# Altium project Debugger.PrjPcb
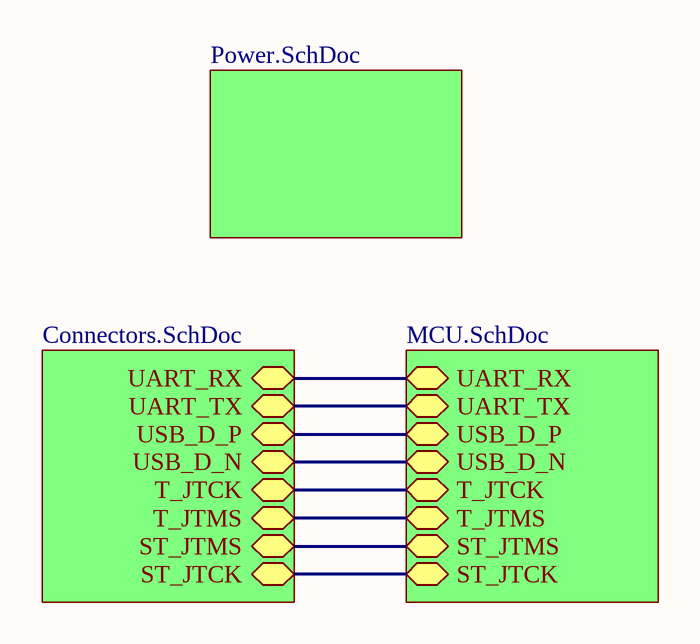
[diagram p0: TOP.SchDoc]
4 sheets, 39 parts. Net scope: hierarchical (ports join the sheet entries above them; power ports are global).
Board file: Debugger.PcbDoc
Sheets:
  TOP.SchDoc
    MCU = MCU.SchDoc
    POWER = Power.SchDoc
    CONNECTORS = Connectors.SchDoc

## Sheet TOP.SchDoc
size A4; Organization: Altium Limited; Address1: L3, 12a Rodborough Rd; Address2: Frenchs Forest; Address3: NSW; Address4: Australia 2086

### Sub-sheets
CONNECTORS = Connectors.SchDoc: UART_RX (bidir), UART_TX (bidir), USB_D_P (bidir), USB_D_N (bidir), T_JTCK (bidir), T_JTMS (bidir), ST_JTMS (bidir), ST_JTCK (bidir)
MCU = MCU.SchDoc: UART_RX (bidir), UART_TX (bidir), USB_D_P (bidir), USB_D_N (bidir), T_JTCK (bidir), T_JTMS (bidir), ST_JTMS (bidir), ST_JTCK (bidir)
POWER = Power.SchDoc: no entries

### Nets
ST_JTCK: sheet MCU/ST_JTCK, sheet CONNECTORS/ST_JTCK
ST_JTMS: sheet MCU/ST_JTMS, sheet CONNECTORS/ST_JTMS
T_JTCK: sheet MCU/T_JTCK, sheet CONNECTORS/T_JTCK
T_JTMS: sheet MCU/T_JTMS, sheet CONNECTORS/T_JTMS
UART_RX: sheet MCU/UART_RX, sheet CONNECTORS/UART_RX
UART_TX: sheet MCU/UART_TX, sheet CONNECTORS/UART_TX
USB_D_N: sheet MCU/USB_D_N, sheet CONNECTORS/USB_D_N
USB_D_P: sheet MCU/USB_D_P, sheet CONNECTORS/USB_D_P

### Notes on the sheet
- Title
- Size:
- Date:
- A4
- Number:
- Time:
- Revision:
- Sheet
- of
- File:

## Sheet MCU.SchDoc
size A4; Organization: Altium Limited; Address1: L3, 12a Rodborough Rd; Address2: Frenchs Forest; Address3: NSW; Address4: Australia 2086
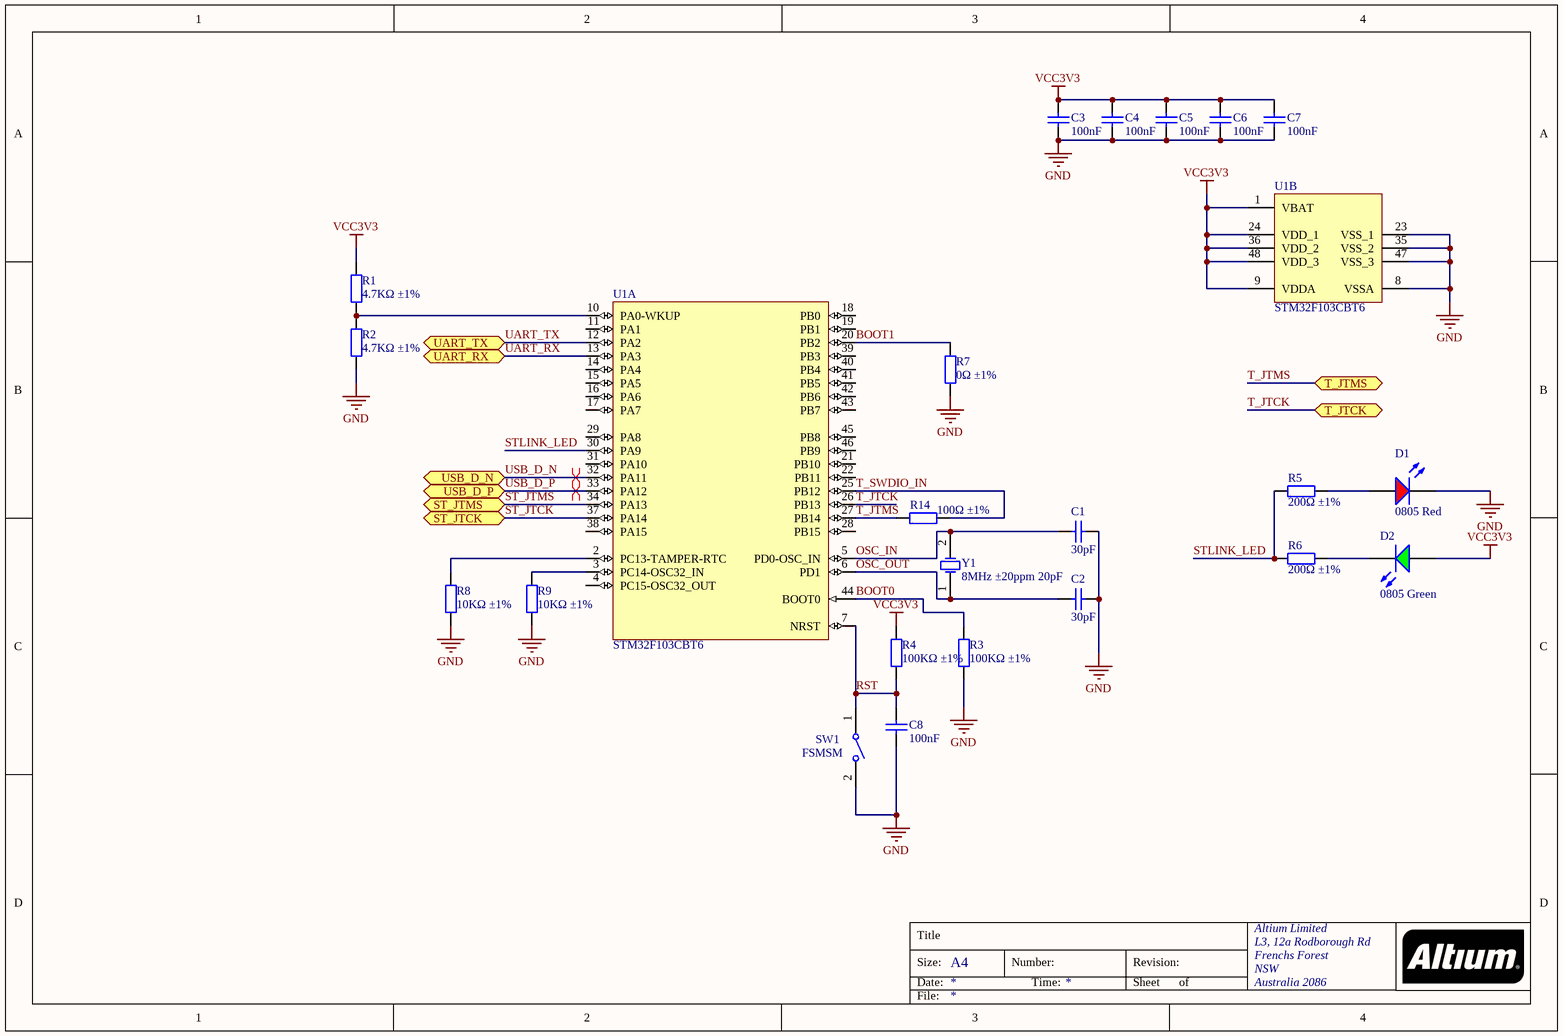
[diagram p1: MCU.SchDoc]

### Parts
C1  30pF  [0402_C]
C2  30pF  [0402_C]
C3  100nF  [0402_C]
C4  100nF  [0402_C]
C5  100nF  [0402_C]
C6  100nF  [0402_C]
C7  100nF  [0402_C]
C8  100nF  [0402_C]
D1  0805 Red  [0805_LED_S1]
D2  0805 Green  [0805_LED_S1]
R1  4.7KΩ ±1%  [0805_R]
R2  4.7KΩ ±1%  [0805_R]
R3  100KΩ ±1%  [0402_R]
R4  100KΩ ±1%  [0402_R]
R5  200Ω ±1%  [0402_R]
R6  200Ω ±1%  [0402_R]
R7  0Ω ±1%  [0402_R]
R8  10KΩ ±1%  [0402_R]
R9  10KΩ ±1%  [0402_R]
R14  100Ω ±1%  [0402_R]
SW1  FSMSM  [TECO-FSMSM-2_V]
U1  STM32F103CBT6  [LQFP-48_7x7x05P]  (parts A,B of 2)
Y1  8MHz ±20ppm 20pF  [SMD-5032_2P]

### Ports
ST_JTCK (bidir), ST_JTMS (bidir), T_JTCK (bidir), T_JTMS (bidir), UART_RX (bidir), UART_TX (bidir), USB_D_N (bidir), USB_D_P (bidir)

### Nets
GND: C1.2 C2.2 C3.1 C4.1 C5.1 C6.1 C7.1 C8.1 D1.K R2.1 R3.1 R7.1 R8.1 R9.1 SW1.2 U1.8(VSSA) U1.23(VSS_1) U1.35(VSS_2) U1.47(VSS_3)
VCC3V3: C3.2 C4.2 C5.2 C6.2 C7.2 D2.A R1.2 R4.2 U1.1(VBAT) U1.9(VDDA) U1.24(VDD_1) U1.36(VDD_2) U1.48(VDD_3)
BOOT0: R3.2 U1.44(BOOT0)
BOOT1: R7.2 U1.20(PB2)
OSC_IN: C1.1 U1.5(PD0-OSC_IN) Y1.2(OSC2)
OSC_OUT: C2.1 U1.6(PD1) Y1.1(OSC1)
RST: C8.2 R4.1 SW1.1 U1.7(NRST)
ST_JTCK: U1.37(PA14) ; port ST_JTCK
ST_JTMS: U1.34(PA13) ; port ST_JTMS
STLINK_LED: R5.1 R6.1 U1.30(PA9)
T_JTCK: U1.26(PB13) ; port T_JTCK
T_JTMS: R14.2 U1.27(PB14) ; port T_JTMS
T_SWDIO_IN: R14.1 U1.25(PB12)
UART_RX: U1.13(PA3) ; port UART_RX
UART_TX: U1.12(PA2) ; port UART_TX
USB_D_N: U1.32(PA11) ; port USB_D_N
USB_D_P: U1.33(PA12) ; port USB_D_P
NetD1_A: D1.A R5.2
NetD2_K: D2.K R6.2
NetR1_1: R1.1 R2.2 U1.10(PA0-WKUP)
NetR8_2: R8.2 U1.2(PC13-TAMPER-RTC)
NetR9_2: R9.2 U1.3(PC14-OSC32_IN)

Not connected (* = marked no-connect by the designer): U1 4(PC15-OSC32_OUT) 11(PA1) 14(PA4) 15(PA5) 16(PA6) 17(PA7) 18(PB0) 19(PB1) 21(PB10) 22(PB11) 28(PB15) 29(PA8) 31(PA10) 38(PA15) 39(PB3) 40(PB4) 41(PB5) 42(PB6) 43(PB7) 45(PB8) 46(PB9)

### Layout directives
differential pair: USB_D_N, USB_D_P

### Notes on the sheet
- Title
- Size:
- Date:
- A4
- Number:
- Time:
- Revision:
- Sheet
- of
- File:

### Library data of the parts
C1 C2 = 0402 30pF (300) 5% 50V: Chip capacitors; Manufacturer: Guangdong Fenghua Advanced Tech; PartNumber: 0402CG300J500NT; Tolerance: 5%; Voltage: 50V; ComponentLink1Description: Supplier link; ComponentLink1URL: http://www.szlcsc.com/product/details_1922.html; Package: 0402; Supplier: LC; SuppliersPartNumber: C1570; Capacitance: 30pF
C3-C8 = 0402 100nF (104) 10% 16V: Chip capacitors; Manufacturer: Samsung Electro-Mechanics; PartNumber: CL05B104KO5NNNC; Tolerance: 10%; Voltage: 16V; ComponentLink1Description: Supplier link; ComponentLink1URL: http://www.szlcsc.com/product/details_1877.html; Package: 0402; Supplier: LC; SuppliersPartNumber: C1525; Capacitance: 100nF
D1 = 0805 LED Red: LED; ComponentLink1Description: 供应商链接; ComponentLink1URL: http://www.szlcsc.com/product/details_2668.html; Package: 0805; Supplier: LC; SuppliersPartNumber: C2295; Color: Red
D2 = 0805 LED Green: LED; ComponentLink1Description: 供应商链接; ComponentLink1URL: http://www.szlcsc.com/product/details_2670.html; Package: 0805; Supplier: LC; SuppliersPartNumber: C2297; Color: Green
R1 R2 = 0805 4.7K (4701) 1%: Chip resistor; Manufacturer: Uniroyal Elec; Power: 1/8W; ComponentLink1Description: Supplier link; ComponentLink1URL: http://www.szlcsc.com/product/details_18361.html; Package: 0805; Supplier: LC; SuppliersPartNumber: C17673; Tolerance: 1%
R3 R4 = 0402 100K (1003) 1%: Chip resistor; Manufacturer: Uniroyal Elec; PartNumber: 0402WGF1003TCE; Power: 1/16W; ComponentLink1Description: Supplier link; ComponentLink1URL: http://www.szlcsc.com/product/details_26484.html; Package: 0402; Supplier: LC; SuppliersPartNumber: C25741; Resistance: 100KΩ; Tolerance: 1%
R5 R6 = 0402 200R (2000) 1%: Chip resistor; Manufacturer: Uniroyal Elec; PartNumber: 0402WGF2000TCE; Power: 1/16W; ComponentLink1Description: Supplier link; ComponentLink1URL: http://www.szlcsc.com/product/details_25830.html; Package: 0402; Supplier: LC; SuppliersPartNumber: C25087; Resistance: 200Ω; Tolerance: 1%
R7 = 0402 0R (0R0) 1%: Chip resistor; Manufacturer: Uniroyal Elec; PartNumber: 0402WGF0000TCE; Power: 1/16W; ComponentLink1Description: Supplier link; ComponentLink1URL: http://www.szlcsc.com/product/details_17853.html; Package: 0402; Supplier: LC; SuppliersPartNumber: C17168; Resistance: 0Ω; Tolerance: 1%
R8 R9 = 0402 10K (1002) 1%: Chip resistor; Manufacturer: Uniroyal Elec; PartNumber: 0402WGF1002TCE; Power: 1/16W; ComponentLink1Description: Supplier link; ComponentLink1URL: http://www.szlcsc.com/product/details_26487.html; Package: 0402; Supplier: LC; SuppliersPartNumber: C25744; Resistance: 10KΩ; Tolerance: 1%
R14 = 0402 100R (1000) 1%: Chip resistor; Manufacturer: Uniroyal Elec; PartNumber: 0402WGF1000TCE; Power: 1/16W; ComponentLink1Description: Supplier link; ComponentLink1URL: http://www.szlcsc.com/product/details_25819.html; Package: 0402; Supplier: LC; SuppliersPartNumber: C25076; Resistance: 100Ω; Tolerance: 1%
SW1 = CMP-2000-07511-1: FSMSM Push Button Switch, 50 mA, -35 to 85 degC, 2-Pin SMD, RoHS, Bulk; Manufacturer: TE Connectivity; Actuator Length: 1.07mm; Electrical Life: 20000Cycles; Actuator Material: Polyamide; Current Rating: 50mA; Illumination Type: Illuminated; Voltage Rating (DC): 24V; Contact Resistance: 100mOhm; Case\/Package: SMD/SMT; Operating Force: 180gf; Switch Travel: 0.25mm; Max Voltage Rating (DC): 12V; Throw Configuration: SPST; Packaging: LoosePiece; Max Operating Temperature: 85degC; ELV: Compliant; Package Description: 2-Pin Surface Mount Device, Body 6 x 3.5 mm, Pitch 9.19 mm; RoHSCompliant: true; Manufacturer URL: http://www.te.com/; Contact Plating: Silver; Contact Material: Brass; Mounting Technology: SurfaceMount; Contact Current Rating: 50mA; Datasheet Version: Rev. C2, 08/2014; Datasheet URL: http://www.te.com/commerce/DocumentDelivery/DDEController?Action=showdoc&DocId=Customer+Drawing%7F1437566-3%7FC2%7Fpdf%7FEnglish%7FENG_CD_1437566-3_C2_1437566_3_1_c.dwg.pdf%7F1437566-3; Mechanical Life: 20000Cycles; Package Reference: FSMSM; REACH SVHC: Unknown; Orientation: Straight; Min Operating Temperature: -35degC; Lead Free: LeadFree; Termination: GullWing; Package Quantity: 1000; Mount: SurfaceMount
U1 = STM32F103CBT6: ARM; ComponentLink1Description: 供应商链接; ComponentLink1URL: http://www.szlcsc.com/product/details_8796.html; Package: LQFP-48_7x7x05P; Supplier: LC; SuppliersPartNumber: C8304
Y1 = SMD-5032_2P 8MHz 20ppm 20pF: 贴片晶振; ComponentLink1Description: 供应商链接; ComponentLink1URL: http://www.szlcsc.com/product/details_117214.html; Package: SMD-5032_2P; Supplier: LC; SuppliersPartNumber: C115962

## Sheet Power.SchDoc
size A4; Organization: Altium Limited; Address1: L3, 12a Rodborough Rd; Address2: Frenchs Forest; Address3: NSW; Address4: Australia 2086
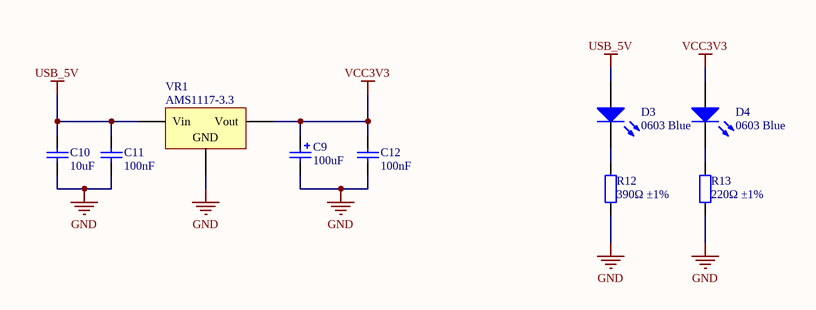
[diagram p2: Power.SchDoc]

### Parts
C9  100uF  [CASE-B_3528]
C10  10uF  [1206_C]
C11  100nF  [0402_C]
C12  100nF  [1206_C]
D3  0603 Blue  [0603_LED_S1]
D4  0603 Blue  [0603_LED_S1]
R12  390Ω ±1%  [0603_R]
R13  220Ω ±1%  [0402_R]
VR1  AMS1117-3.3  [SOT-223]

### Nets
GND: C9.2 C10.1 C11.1 C12.1 R12.1 R13.1 VR1.1(GND)
USB_5V: C10.2 C11.2 D3.A VR1.3(Vin)
VCC3V3: C9.1 C12.2 D4.A VR1.2(Vout)
NetD3_K: D3.K R12.2
NetD4_K: D4.K R13.2

### Notes on the sheet
- Title
- Size:
- Date:
- A4
- Number:
- Time:
- Revision:
- Sheet
- of
- File:

### Library data of the parts
C9 = 3528 100uF (107) 10% 6.3V: Tantalum capacitor; Manufacturer: AVX; PartNumber: TAJB107K006RNJ; Tolerance: 10%; Voltage: 6.3V; ComponentLink1Description: Supplier link; ComponentLink1URL: http://www.szlcsc.com/product/details_16815.html; Package: 3528; Supplier: LC; SuppliersPartNumber: C16133; Capacitance: 100uF
C10 = 1206 10uF (106) 10% 50V: Chip capacitors; Manufacturer: Samsung Electro-Mechanics; PartNumber: CL31A106KBHNNNE; Tolerance: 10%; Voltage: 50V; ComponentLink1Description: Supplier link; ComponentLink1URL: http://www.szlcsc.com/product/details_14236.html; Package: 1206; Supplier: LC; SuppliersPartNumber: C13585; Capacitance: 10uF
C11 = 0402 100nF (104) 10% 16V: as C3 on sheet MCU; ComponentLink1Description: Supplier link; ComponentLink1URL: http://www.szlcsc.com/product/details_1877.html; Package: 0402; Supplier: LC; SuppliersPartNumber: C1525; Capacitance: 100nF
C12 = 1206 100nF (104) 10% 50V: Chip capacitors; Manufacturer: Samsung Electro-Mechanics; PartNumber: CL31B104KBCNNNC; Tolerance: 10%; Voltage: 50V; ComponentLink1Description: Supplier link; ComponentLink1URL: http://www.szlcsc.com/product/details_25237.html; Package: 1206; Supplier: LC; SuppliersPartNumber: C24497; Capacitance: 100nF
D3 D4 = 0603 LED Blue: LED; ComponentLink1Description: 供应商链接; ComponentLink1URL: http://www.szlcsc.com/product/details_73150.html; Package: 0603; Supplier: LC; SuppliersPartNumber: C72041; Color: Blue
R12 = 0603 390R (3900) 1%: Chip resistor; Manufacturer: Uniroyal Elec; PartNumber: 0603WAF3900T5E; Power: 1/10W; ComponentLink1Description: Supplier link; ComponentLink1URL: http://www.szlcsc.com/product/details_23878.html; Package: 0603; Supplier: LC; SuppliersPartNumber: C23151; Resistance: 390Ω; Tolerance: 1%
R13 = 0402 220R (2200) 1%: Chip resistor; Manufacturer: Uniroyal Elec; PartNumber: 0402WGF2200TCE; Power: 1/16W; ComponentLink1Description: Supplier link; ComponentLink1URL: http://www.szlcsc.com/product/details_25834.html; Package: 0402; Supplier: LC; SuppliersPartNumber: C25091; Resistance: 220Ω; Tolerance: 1%
VR1 = SOT-223 AMS1117-3.3: 低压差线性稳压(LDO); ComponentLink1Description: 供应商链接; ComponentLink1URL: http://www.szlcsc.com/product/details_6652.html; Package: SOT-223; Supplier: LC; SuppliersPartNumber: C6186

## Sheet Connectors.SchDoc
size A4; Organization: Altium Limited; Address1: L3, 12a Rodborough Rd; Address2: Frenchs Forest; Address3: NSW; Address4: Australia 2086
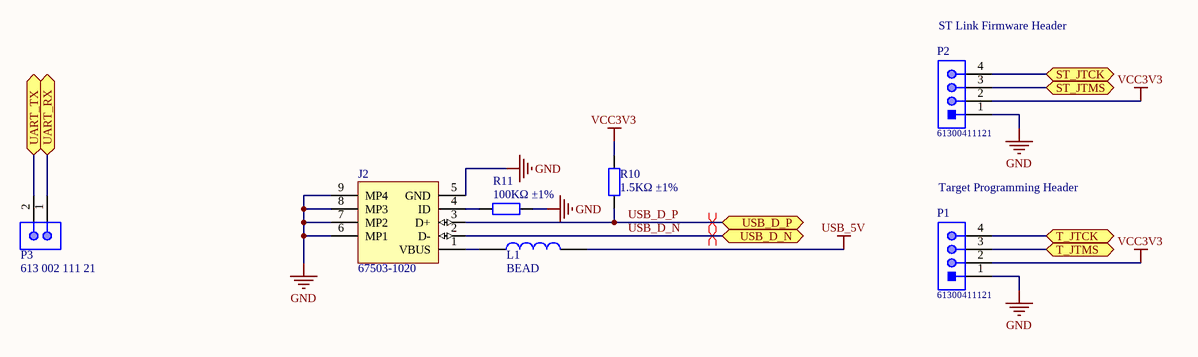
[diagram p3: Connectors.SchDoc]

### Parts
J2  67503-1020  [MOLX-67503-1020_V]
L1  BEAD  [0603_L]
P1  61300411121  [61300411121]
P2  61300411121  [61300411121]
P3  613 002 111 21  [WE-61300211121_V]
R10  1.5KΩ ±1%  [0402_R]
R11  100KΩ ±1%  [0402_R]

### Ports
ST_JTCK (bidir), ST_JTMS (bidir), T_JTCK (bidir), T_JTMS (bidir), UART_RX (bidir), UART_TX (bidir), USB_D_N (bidir), USB_D_P (bidir)

### Nets
GND: J2.5(GND) J2.6(MP1) J2.7(MP2) J2.8(MP3) J2.9(MP4) P1.1 P2.1 R11.2
USB_5V: L1.2
VCC3V3: P1.2 P2.2 R10.2
ST_JTCK: P2.4 ; port ST_JTCK
ST_JTMS: P2.3 ; port ST_JTMS
T_JTCK: P1.4 ; port T_JTCK
T_JTMS: P1.3 ; port T_JTMS
UART_RX: P3.1 ; port UART_RX
UART_TX: P3.2 ; port UART_TX
USB_D_N: J2.2(D-) ; port USB_D_N
USB_D_P: J2.3(D+) R10.1 ; port USB_D_P
NetJ2_1: J2.1(VBUS) L1.1
NetJ2_4: J2.4(ID) R11.1

### Layout directives
differential pair: USB_D_N, USB_D_P

### Notes on the sheet
- (near P2) ST Link Firmware Header
- (near P1) Target Programming Header
- Title
- Size:
- Date:
- A4
- Number:
- Time:
- Revision:
- Sheet
- of
- File:

### Library data of the parts
J2 = CMP-0411-00002-1: USB, MINI, SMD, RA KME04-USBMU03A01; Manufacturer: Molex; ComponentLink1URL: http://www.molex.com/; PartNumber: 67503-1020; Mounting Technology: Surface Mount; ComponentLink1Description: Manufacturer URL; Terminal Pitch: 0.8 mm; DatasheetVersion: Rev F, 06/2009; ComponentLink2Description: Datasheet; PackageDescription: Mini USB Connector, SMT, Righer Angle; ComponentLink2URL: http://www.molex.com/pdm_docs/sd/675031020_sd.pdf; PackageReference: 67503-1020
L1 = 0603 100R@100Mhz 1A: Ferrite Bead; Notepad: *; Package: 0603; Supplier: LC; SuppliersPartNumber: C64181
P1 P2 = CMP-1502-01064-1: THT Vertical Pin Header WR-PHD, Pitch 2.54 mm, Single Row, 4 pins; Manufacturer: Wurth Elektronik; Withstanding Voltage: 500VAC; Rated Current: 3A; Working Voltage: 250VAC; Pin Number: 4; Gender: Male; Contact Resistance: 20mOhm; Pitch: 2.54mm; Manufacturer URL: http://www.we-online.de; Operating Temperature: -40to105degC; Packaging: Bag; Mounting Technology: THT; Package Reference: 61300411121; Datasheet URL: https://katalog.we-online.de/em/datasheet/6130xx11121.pdf; Publisher: WurthElektronik; Part Number: 61300411121; Row Number: Single; Orientation: Vertical
P3 = CMP-1712-00002-3: Male Header, Pitch 2.54 mm, 1 x 2 Position, Height 8.54 mm, Tail Length 3 mm, -40 to 105 degC, RoHS, Bulk; Mounting Technology: Through Hole; Packaging: Bulk; Pins: 2; REACH SVHC: No SVHC; PartNumber: 613 002 111 21; PackageDescription: Male Header, Pitch 2.54 mm, 1 x 2 Position, Height 8.54 mm, Tail Length 3 mm; ComponentLink1Description: Manufacturer URL; Max Operating Temperature: 125 degC; ComponentLink1URL: https://www.we-online.com/; ComponentLink2Description: Datasheet; Mount: Through Hole; DatasheetVersion: Rev. J; Min Operating Temperature: -40 degC; ComponentLink2URL: http://katalog.we-online.de/em/datasheet/6130xx11121.pdf; RoHSCompliant: True
R10 = 0402 1.5K (1501) 1%: Chip resistor; Manufacturer: Uniroyal Elec; PartNumber: 0402WGF1501TCE; Power: 1/16W; ComponentLink1Description: Supplier link; ComponentLink1URL: http://www.szlcsc.com/product/details_26610.html; Package: 0402; Supplier: LC; SuppliersPartNumber: C25867; Resistance: 1.5KΩ; Tolerance: 1%
R11 = 0402 100K (1003) 1%: as R3 on sheet MCU; ComponentLink1Description: Supplier link; ComponentLink1URL: http://www.szlcsc.com/product/details_26484.html; Package: 0402; Supplier: LC; SuppliersPartNumber: C25741; Resistance: 100KΩ; Tolerance: 1%

## Nets that join several sheets
GND: MCU (19 pins), Power (7 pins), Connectors (8 pins)
USB_5V: Power (C10.2 C11.2 D3.A VR1.3), Connectors (L1.2)
VCC3V3: MCU (13 pins), Power (C9.1 C12.2 D4.A VR1.2), Connectors (P1.2 P2.2 R10.2)
ST_JTCK: MCU (U1.37), Connectors (P2.4)
ST_JTMS: MCU (U1.34), Connectors (P2.3)
T_JTCK: MCU (U1.26), Connectors (P1.4)
T_JTMS: MCU (R14.2 U1.27), Connectors (P1.3)
UART_RX: MCU (U1.13), Connectors (P3.1)
UART_TX: MCU (U1.12), Connectors (P3.2)
USB_D_N: MCU (U1.32), Connectors (J2.2)
USB_D_P: MCU (U1.33), Connectors (J2.3 R10.1)